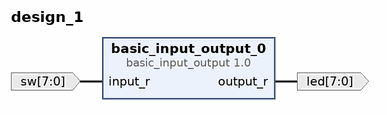
[diagram p0: block diagram of the top level]
# Vivado block design design_1, xc7z020clg400-1, Vivado 2020.2
create_bd_design design_1

create_bd_port -dir I -from 7 -to 0 -type data sw
create_bd_port -dir O -from 7 -to 0 -type data led

create_bd_cell -type ip -vlnv xilinx.com:hls:basic_input_output:1.0 basic_input_output_0

# ---- connections ----

connect_bd_net -net input_r_0_1 [get_bd_ports sw] [get_bd_pins basic_input_output_0/input_r]
connect_bd_net [get_bd_pins basic_input_output_0/output_r] [get_bd_ports led]

validate_bd_design
save_bd_design
